# EAGLE design mm_robot_pcb_v2 (EAGLE 9.6.2)
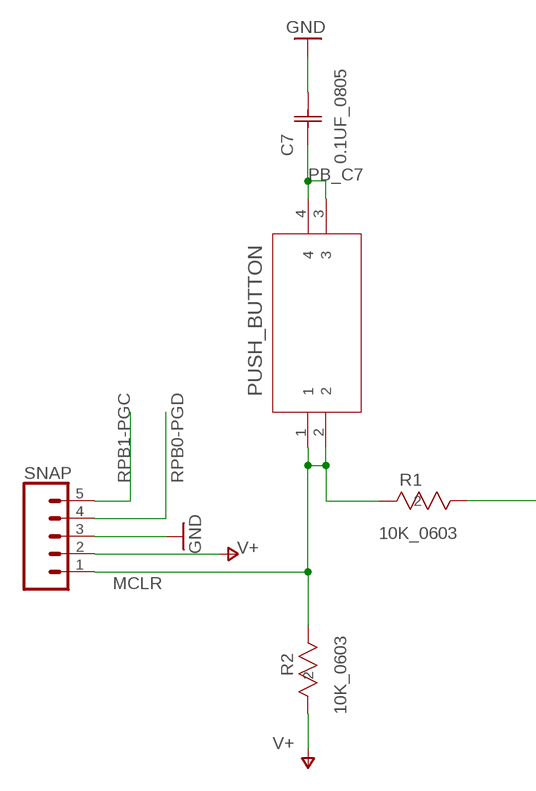
[diagram p0: schematic, sheet 1, part 1 of 2]
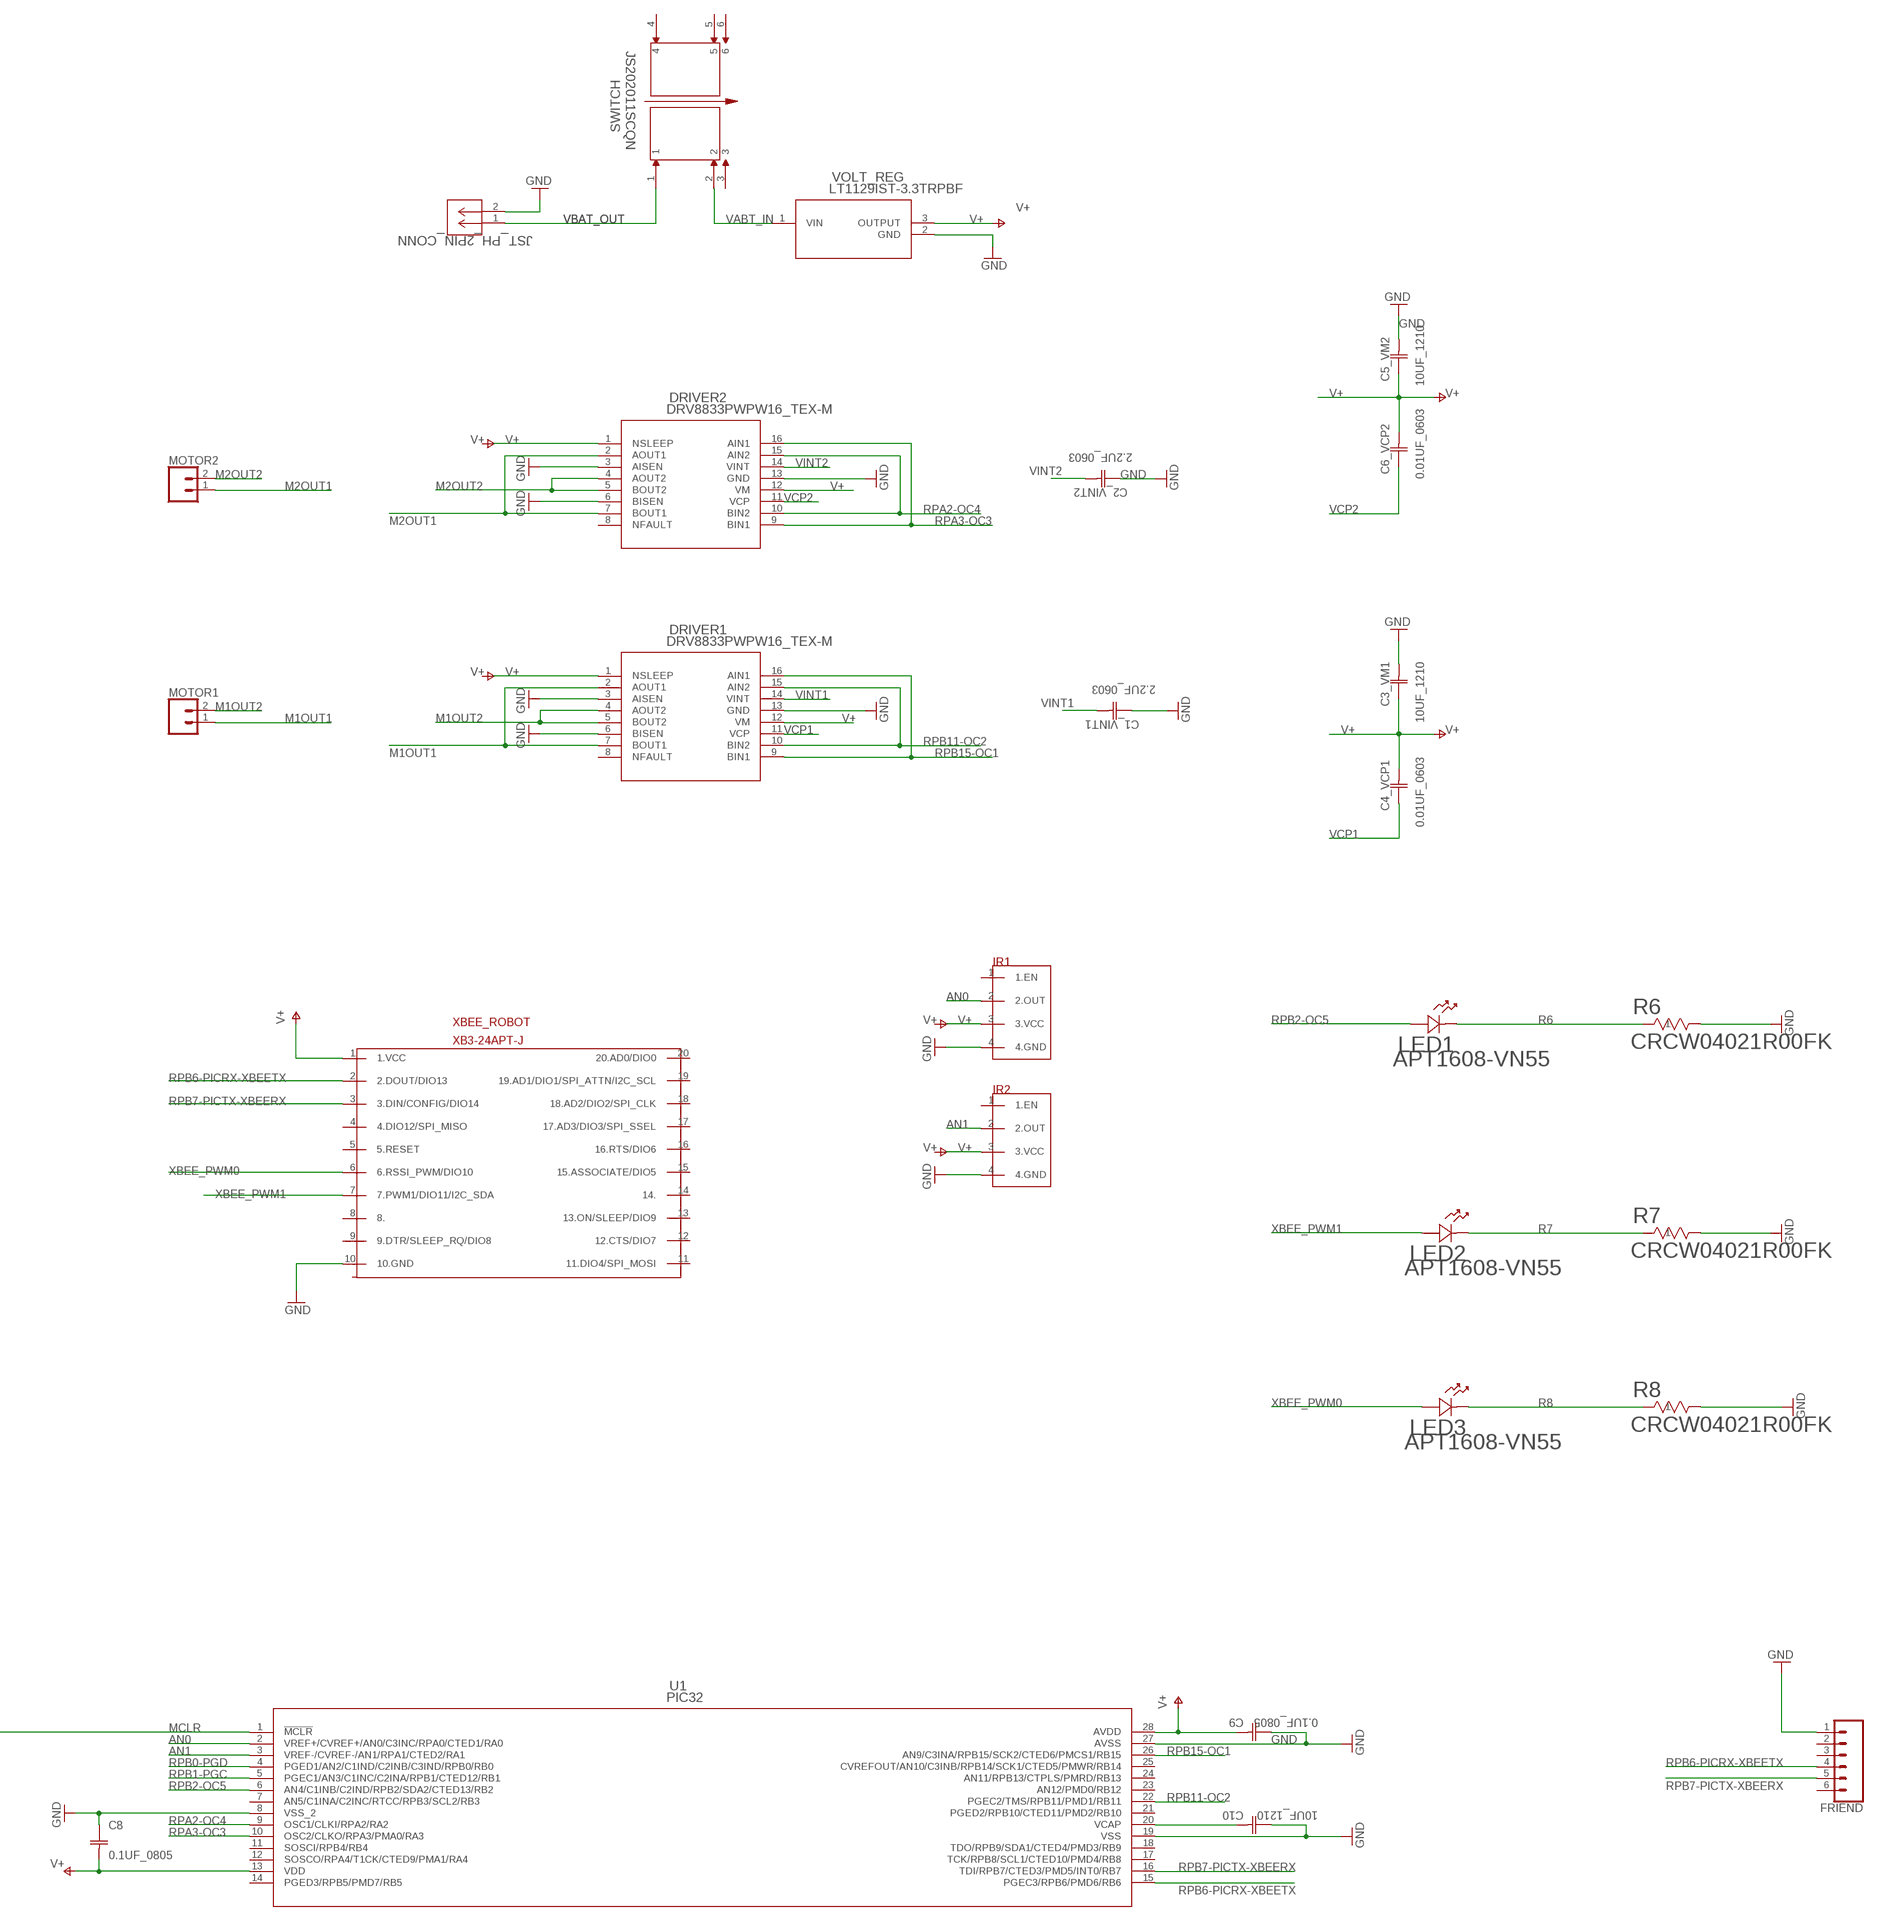
[diagram p1: schematic, sheet 1, part 2 of 2]

## Parts
C1_VINT1  2.2UF_0603  CL10A225KP8NNNC  [CAP_CL10_SAM]
C2_VINT2  2.2UF_0603  CL10A225KP8NNNC  [CAP_CL10_SAM]
C3_VM1  10UF_1210  TPSB106K016R0500  [CAP_TPS_B_AVX]
C4_VCP1  0.01UF_0603  01UF_CAP  [CAP_01UF_0603_X7R_G_AVX]
C5_VM2  10UF_1210  TPSB106K016R0500  [CAP_TPS_B_AVX]
C6_VCP2  0.01UF_0603  01UF_CAP  [CAP_01UF_0603_X7R_G_AVX]
C7  0.1UF_0805  C2012X7R2A104K125AA  [CAP_C2012X7R2A104K125AA_TDK]
C8  0.1UF_0805  C2012X7R2A104K125AA  [CAP_C2012X7R2A104K125AA_TDK]
C9  0.1UF_0805  C2012X7R2A104K125AA  [CAP_C2012X7R2A104K125AA_TDK]
C10  10UF_1210  TPSB106K016R0500  [CAP_TPS_B_AVX]
DRIVER1  DRV8833PWPW16_TEX-M  [PW16_TEX-M]
DRIVER2  DRV8833PWPW16_TEX-M  [PW16_TEX-M]
FRIEND  CONN_06LOCK  [1X06_LOCK]
IR1  GP2Y0A60SZLF  [1X04]
IR2  GP2Y0A60SZLF  [1X04]
JST_PH_2PIN_CONN  1769  [CONN_1769_ADA]
LED1  APT1608-VN55  [LED_APT1608_KNB]
LED2  APT1608-VN55  [LED_APT1608_KNB]
LED3  APT1608-VN55  [LED_APT1608_KNB]
MOTOR1  CONN_02  [1X02]
MOTOR2  CONN_02  [1X02]
R1  10K_0603  CRG0603F10K  [RES0603_CRG_TYCO_TYC]
R2  10K_0603  CRG0603F10K  [RES0603_CRG_TYCO_TYC]
R6  CRCW04021R00FK  [RES_CRCW0402_VIS]
R7  CRCW04021R00FK  [RES_CRCW0402_VIS]
R8  CRCW04021R00FK  [RES_CRCW0402_VIS]
SNAP  CONN_05  [1X05]
SWITCH  JS202011SCQN  [SW_JS202011SCQN]
U1  PIC32  PIC32MX170F256B-I/SS  [SSOP28_MC_MCH]
U2  PUSH_BUTTON  PTS526_SK15_SMTR2_LFS  [SMT_FS]
VOLT_REG  LT1129IST-3.3TRPBF  [SOT-223_ST_LIT]
XBEE_ROBOT  XB3-24APT-J  [XB3-24APT-J]

## Nets
AN0: IR1.2(2.OUT) U1.2(VREF+/CVREF+/AN0/C3INC/RPA0/CTED1/RA0)
AN1: IR2.2(2.OUT) U1.3(VREF-/CVREF-/AN1/RPA1/CTED2/RA1)
GND: C1_VINT1.1 C2_VINT2.1 C3_VM1.2 C5_VM2.2 C7.2 C8.1 C9.1 C10.1 DRIVER1.3(AISEN) DRIVER1.6(BISEN) DRIVER1.13(GND) DRIVER2.3(AISEN) DRIVER2.6(BISEN) DRIVER2.13(GND) FRIEND.1 IR1.4(4.GND) IR2.4(4.GND) JST_PH_2PIN_CONN.2 R6.2 R7.2 R8.2 SNAP.3 U1.8(VSS_2) U1.19(VSS) U1.27(AVSS) VOLT_REG.2(GND) XBEE_ROBOT.10(10.GND)
M1OUT1: DRIVER1.2(AOUT1) DRIVER1.7(BOUT1) MOTOR1.1
M1OUT2: DRIVER1.4(AOUT2) DRIVER1.5(BOUT2) MOTOR1.2
M2OUT1: DRIVER2.2(AOUT1) DRIVER2.7(BOUT1) MOTOR2.1
M2OUT2: DRIVER2.4(AOUT2) DRIVER2.5(BOUT2) MOTOR2.2
MCLR: R1.1 R1.2 R2.1 SNAP.1 U1.1(!MCLR) U2.1 U2.2
N$3: C10.2 U1.20(VCAP)
PB_C7: C7.1 U2.3 U2.4
R6: LED1.1 R6.1
R7: LED2.1 R7.1
R8: LED3.1 R8.1
RPA2-OC4: DRIVER2.10(BIN2) DRIVER2.15(AIN2) U1.9(OSC1/CLKI/RPA2/RA2)
RPA3-OC3: DRIVER2.9(BIN1) DRIVER2.16(AIN1) U1.10(OSC2/CLKO/RPA3/PMA0/RA3)
RPB0-PGD: SNAP.4 U1.4(PGED1/AN2/C1IND/C2INB/C3IND/RPB0/RB0)
RPB1-PGC: SNAP.5 U1.5(PGEC1/AN3/C1INC/C2INA/RPB1/CTED12/RB1)
RPB2-OC5: LED1.2 U1.6(AN4/C1INB/C2IND/RPB2/SDA2/CTED13/RB2)
RPB6-PICRX-XBEETX: FRIEND.4 U1.15(PGEC3/RPB6/PMD6/RB6) XBEE_ROBOT.2(2.DOUT/DIO13)
RPB7-PICTX-XBEERX: FRIEND.5 U1.16(TDI/RPB7/CTED3/PMD5/INT0/RB7) XBEE_ROBOT.3(3.DIN/CONFIG/DIO14)
RPB11-OC2: DRIVER1.10(BIN2) DRIVER1.15(AIN2) U1.22(PGEC2/TMS/RPB11/PMD1/RB11)
RPB15-OC1: DRIVER1.9(BIN1) DRIVER1.16(AIN1) U1.26(AN9/C3INA/RPB15/SCK2/CTED6/PMCS1/RB15)
V+: C3_VM1.1 C4_VCP1.2 C5_VM2.1 C6_VCP2.2 C8.2 C9.2 DRIVER1.1(NSLEEP) DRIVER1.12(VM) DRIVER2.1(NSLEEP) DRIVER2.12(VM) IR1.3(3.VCC) IR2.3(3.VCC) R2.2 SNAP.2 U1.13(VDD) U1.28(AVDD) VOLT_REG.3(OUTPUT) XBEE_ROBOT.1(1.VCC)
VABT_IN: SWITCH.2 VOLT_REG.1(VIN)
VBAT_OUT: JST_PH_2PIN_CONN.1 SWITCH.1
VCP1: C4_VCP1.1 DRIVER1.11(VCP)
VCP2: C6_VCP2.1 DRIVER2.11(VCP)
VINT1: C1_VINT1.2 DRIVER1.14(VINT)
VINT2: C2_VINT2.2 DRIVER2.14(VINT)
XBEE_PWM0: LED3.2 XBEE_ROBOT.6(6.RSSI_PWM/DIO10)
XBEE_PWM1: LED2.2 XBEE_ROBOT.7(7.PWM1/DIO11/I2C_SDA)
Unconnected: DRIVER1.8(NFAULT) DRIVER2.8(NFAULT) FRIEND.2 FRIEND.3 FRIEND.6 IR1.1(1.EN) IR2.1(1.EN) SWITCH.3 SWITCH.4 SWITCH.5 SWITCH.6 U1.7(AN5/C1INA/C2INC/RTCC/RPB3/SCL2/RB3) U1.11(SOSCI/RPB4/RB4) U1.12(SOSCO/RPA4/T1CK/CTED9/PMA1/RA4) U1.14(PGED3/RPB5/PMD7/RB5) U1.17(TCK/RPB8/SCL1/CTED10/PMD4/RB8) U1.18(TDO/RPB9/SDA1/CTED4/PMD3/RB9) U1.21(PGED2/RPB10/CTED11/PMD2/RB10) U1.23(AN12/PMD0/RB12) U1.24(AN11/RPB13/CTPLS/PMRD/RB13) U1.25(CVREFOUT/AN10/C3INB/RPB14/SCK1/CTED5/PMWR/RB14) XBEE_ROBOT.4(4.DIO12/SPI_MISO) XBEE_ROBOT.5(5.RESET) XBEE_ROBOT.8(8.) XBEE_ROBOT.9(9.DTR/SLEEP_RQ/DIO8) XBEE_ROBOT.11(11.DIO4/SPI_MOSI) XBEE_ROBOT.12(12.CTS/DIO7) XBEE_ROBOT.13(13.ON/SLEEP/DIO9) XBEE_ROBOT.14(14.) XBEE_ROBOT.15(15.ASSOCIATE/DIO5) XBEE_ROBOT.16(16.RTS/DIO6) XBEE_ROBOT.17(17.AD3/DIO3/SPI_SSEL) XBEE_ROBOT.18(18.AD2/DIO2/SPI_CLK) XBEE_ROBOT.19(19.AD1/DIO1/SPI_ATTN/I2C_SCL) XBEE_ROBOT.20(20.AD0/DIO0)

## Library data of the parts
C1_VINT1 C2_VINT2 = micromouse:CL10A225KP8NNNC; COPYRIGHT: Copyright (C) 2021 Ultra Librarian. All rights reserved.; MANUFACTURER_PART_NUMBER: CL10A225KP8NNNC; MFR_NAME: Samsung
C3_VM1 C5_VM2 C10 = micromouse:TPSB106K016R0500; COPYRIGHT: Copyright (C) 2021 Ultra Librarian. All rights reserved.; MANUFACTURER_PART_NUMBER: TPSB106K016R0500; MFR_NAME: AVX Corporation
C4_VCP1 C6_VCP2 = micromouse:01UF_CAP
C7-C9 = micromouse:C2012X7R2A104K125AA; COPYRIGHT: Copyright (C) 2021 Ultra Librarian. All rights reserved.; MANUFACTURER_PART_NUMBER: C2012X7R2A104K125AA; MFR_NAME: TDK
DRIVER1 DRIVER2 = DRV8833PW:DRV8833PW; COPYRIGHT: Copyright (C) 2021 Ultra Librarian. All rights reserved.; MANUFACTURER_PART_NUMBER: DRV8833PW; MFR_NAME: Texas Instruments
FRIEND = micromouse:CONN_06: Multi connection point. Often used as Generic Header-pin footprint for 0.1 inch spaced/style header connections On any of the 0.1 inch spaced packages, you can populate with these: Break Away Headers - Straight <https://www.sparkfun.com/products/116> (PRT-00116) Break Away Male Headers - Right Angle <https://www.sparkfun.com/products/553> (PRT-00553) Female Headers <https://www.sparkfun.com/products/115> (PRT-00115) Break Away Headers - Machine Pin <https://www.sparkfun.com/products/117> (PRT-00117) Break Away Female Headers - Swiss Machine Pin <https://www.sparkfun.com/products/743> (PRT-00743) Arduino Stackable Header - 6 Pin <https://www.sparkfun.com/products/9280> (PRT-09280) For SCREWTERMINALS and SPRING TERMINALS visit here: Screw Terimnals on SparkFun.com <https://www.sparkfun.com/search/results?term=Screw+Terminals> (5mm/3.5mm/2.54mm spacing) This device is also useful as a general connection point to wire up your design to another part of your project. Our various solder wires solder well into these plated through hole pads. Hook-Up Wire - Assortment (Stranded, 22 AWG) <https://www.sparkfun.com/products/11375> (PRT-11375) Hook-Up Wire - Assortment (Solid Core, 22 AWG) <https://www.sparkfun.com/products/11367> (PRT-11367) View the entire wire category on our website here <https://www.sparkfun.com/categories/141>
IR1 IR2 = micromouse:GP2Y0A60SZLF
JST_PH_2PIN_CONN = micromouse:1769; COPYRIGHT: Copyright (C) 2021 Ultra Librarian. All rights reserved.; MANUFACTURER_PART_NUMBER: 1769; MFR_NAME: Adafruit Industries
LED1-LED3 = micromouse:APT1608-VN55; COPYRIGHT: Copyright (C) 2021 Ultra Librarian. All rights reserved.; MANUFACTURER_PART_NUMBER: APT1608-VN55; MFR_NAME: Kingbright
MOTOR1 MOTOR2 = micromouse:CONN_02: Multi connection point. Often used as Generic Header-pin footprint for 0.1 inch spaced/style header connections On any of the 0.1 inch spaced packages, you can populate with these: Break Away Headers - Straight <https://www.sparkfun.com/products/116> (PRT-00116) Break Away Male Headers - Right Angle <https://www.sparkfun.com/products/553> (PRT-00553) Female Headers <https://www.sparkfun.com/products/115> (PRT-00115) Break Away Headers - Machine Pin <https://www.sparkfun.com/products/117> (PRT-00117) Break Away Female Headers - Swiss Machine Pin <https://www.sparkfun.com/products/743> (PRT-00743) For SCREWTERMINALS and SPRING TERMINALS visit here: Screw Terimnals on SparkFun.com <https://www.sparkfun.com/search/results?term=Screw+Terminals> (5mm/3.5mm/2.54mm spacing) This device is also useful as a general connection point to wire up your design to another part of your project. Our various solder wires solder well into these plated through hole pads. Hook-Up Wire - Assortment (Stranded, 22 AWG) <https://www.sparkfun.com/products/11375> (PRT-11375) Hook-Up Wire - Assortment (Solid Core, 22 AWG) <https://www.sparkfun.com/products/11367> (PRT-11367) View the entire wire category on our website here <https://www.sparkfun.com/categories/141> Special notes: Molex polarized connector foot print use with: PRT-08233 with associated crimp pins and housings. 2.54_SCREWTERM for use with PRT-10571. 3.5mm Screw Terminal footprints for PRT-08084 5mm Screw Terminal footprints for use with PRT-08432
R1 R2 = micromouse:CRG0603F10K; COPYRIGHT: Copyright (C) 2021 Ultra Librarian. All rights reserved.; MANUFACTURER_PART_NUMBER: CRG0603F10K; MFR_NAME: TE Connectivity
R6-R8 = micromouse:CRCW04021R00FK; COPYRIGHT: Copyright (C) 2021 Ultra Librarian. All rights reserved.; MANUFACTURER_PART_NUMBER: CRCW04021R00FK; MFR_NAME: Vishay
SNAP = micromouse:CONN_05: Multi connection point. Often used as Generic Header-pin footprint for 0.1 inch spaced/style header connections On any of the 0.1 inch spaced packages, you can populate with these: Break Away Headers - Straight <https://www.sparkfun.com/products/116> (PRT-00116) Break Away Male Headers - Right Angle <https://www.sparkfun.com/products/553> (PRT-00553) Female Headers <https://www.sparkfun.com/products/115> (PRT-00115) Break Away Headers - Machine Pin <https://www.sparkfun.com/products/117> (PRT-00117) Break Away Female Headers - Swiss Machine Pin <https://www.sparkfun.com/products/743> (PRT-00743) For SCREWTERMINALS and SPRING TERMINALS visit here: Screw Terimnals on SparkFun.com <https://www.sparkfun.com/search/results?term=Screw+Terminals> (5mm/3.5mm/2.54mm spacing) This device is also useful as a general connection point to wire up your design to another part of your project. Our various solder wires solder well into these plated through hole pads. Hook-Up Wire - Assortment (Stranded, 22 AWG) <https://www.sparkfun.com/products/11375> (PRT-11375) Hook-Up Wire - Assortment (Solid Core, 22 AWG) <https://www.sparkfun.com/products/11367> (PRT-11367) View the entire wire category on our website here <https://www.sparkfun.com/categories/141> Special notes: Molex polarized connector foot print use with SKU : PRT-08231 with associated crimp pins and housings. 1MM SMD Version SKU: PRT-10208
SWITCH = micromouse:JS202011SCQN; COPYRIGHT: Copyright (C) 2021 Ultra Librarian. All rights reserved.; MANUFACTURER_PART_NUMBER: JS202011SCQN; MFR_NAME: C&K
U1 = micromouse:PIC32MX170F256B-I/SS; COPYRIGHT: Copyright (C) 2021 Ultra Librarian. All rights reserved.; MANUFACTURER_PART_NUMBER: PIC32MX170F256B-I/SS; MFR_NAME: Microchip
U2 = micromouse:PTS526_SK15_SMTR2_LFS; COPYRIGHT: Copyright (C) 2021 Ultra Librarian. All rights reserved.; MANUFACTURER_PART_NUMBER: PTS526 SK15 SMTR2 LFS; MFR_NAME: C&K
VOLT_REG = LT1129IST-3.3#TRPBF:LT1129IST-3.3TRPBF; COPYRIGHT: Copyright (C) 2021 Ultra Librarian. All rights reserved.; MANUFACTURER_PART_NUMBER: LT1129IST-3.3#TRPBF; MFR_NAME: Analog Devices / Linear Technology
XBEE_ROBOT = micromouse:XB3-24APT-J

## Board
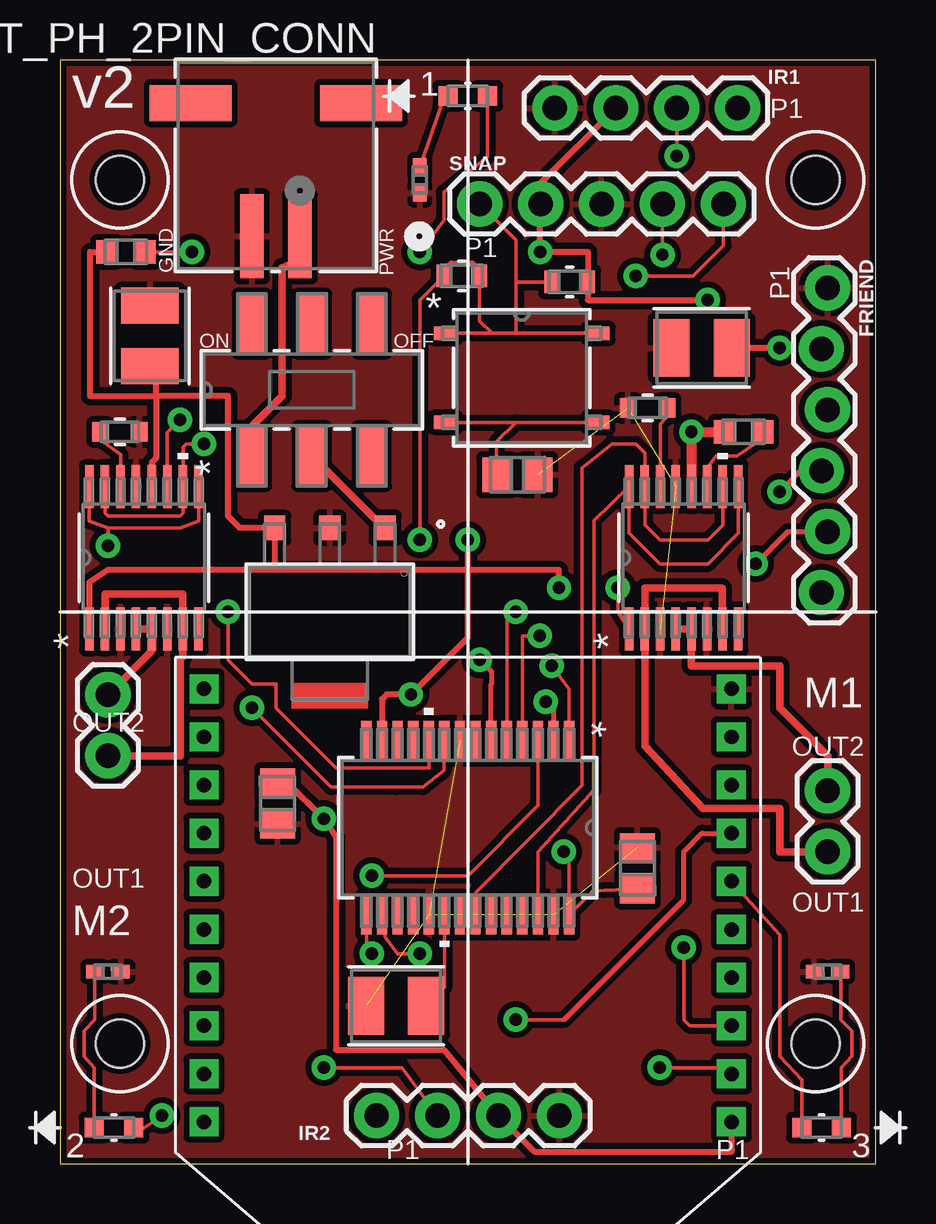
[diagram p2: board, top side]
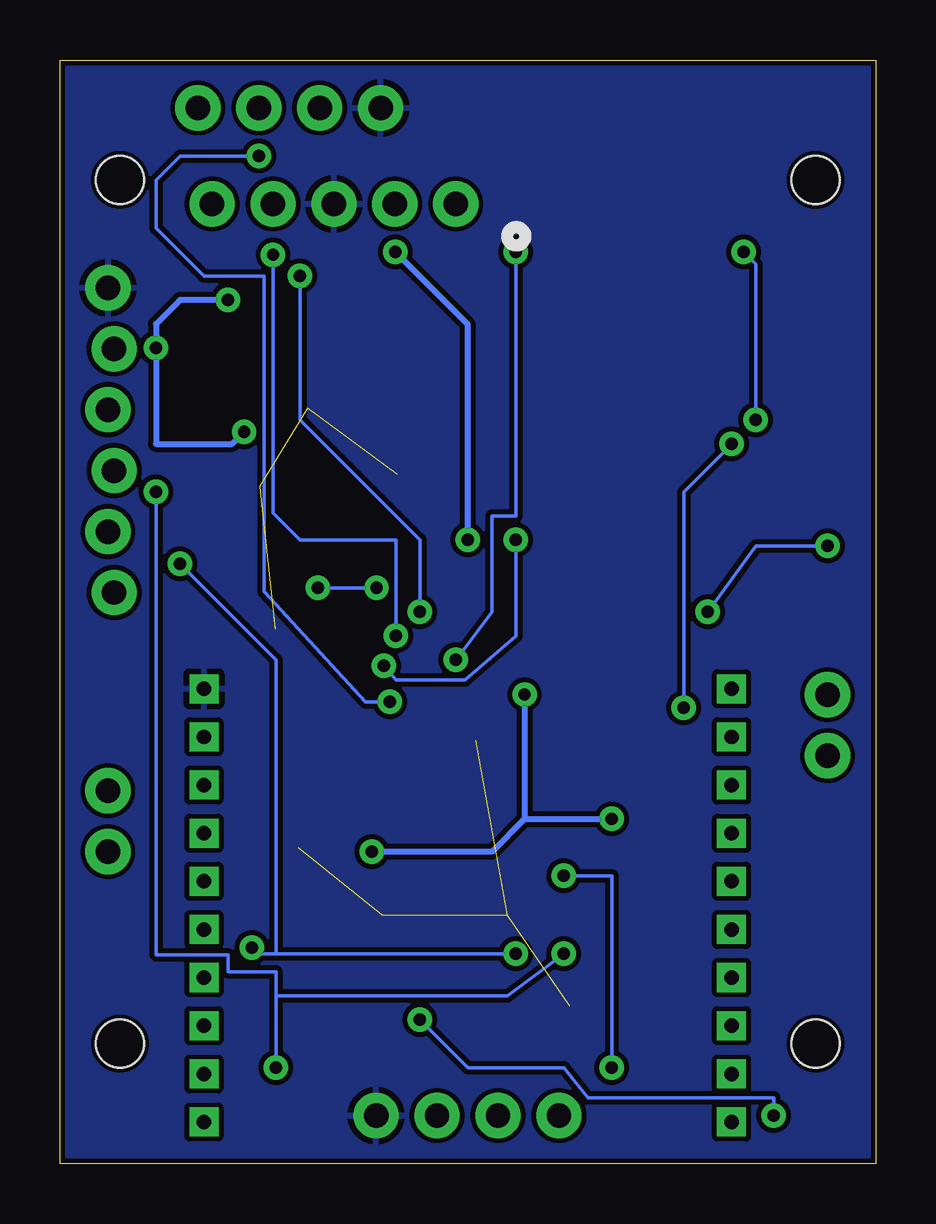
[diagram p3: board, bottom side, seen from below]

Size 34 x 46 mm. Coordinates in mm from the lower left corner, seen from the top.
Outline: 0,0 34,0 34,46 0,46 0,0
Copper layers (1*16): Top 0.035mm / dielectric 1.5mm / Bottom 0.035mm
Design rules "SparkFun": minimum track width 8mil, minimum drill 20mil, track to track 8mil, track to pad 8mil, pad to pad 8mil, via to via 8mil, smd to smd 8mil, copper to edge 8mil, drill to drill 8mil, minimum pad ring 12mil, minimum via ring 10mil, stop-mask expansion 4mil, vias tented up to drill 20mil, thermal gap 10mil
Holes 2 mm at 2.5,5 31.5,5 31.5,41 2.5,41

### Footprints (pad centres in the part's own frame; a part is rotated, then mirrored left to right if it is on the bottom)
CAP_CL10_SAM = smd 0.656 x 0.8: 1 -0.828,0; 2 0.828,0
CAP_TPS_B_AVX = smd 1.498 x 2.413: 1 -1.258,0; 2 1.258,0
CAP_01UF_0603_X7R_G_AVX = smd 0.864 x 0.965: 1 -0.8,0; 2 0.8,0
CAP_C2012X7R2A104K125AA_TDK = smd 1.194 x 1.448: 1 -0.864,0; 2 0.864,0
PW16_TEX-M = smd 1.778 x 0.356: 1 -2.972,2.275; 2 -2.972,1.625; 3 -2.972,0.975; 4 -2.972,0.325; 5 -2.972,-0.325; 6 -2.972,-0.975; 7 -2.972,-1.625; 8 -2.972,-2.275; 9 2.972,-2.275; 10 2.972,-1.625; 11 2.972,-0.975; 12 2.972,-0.325; 13 2.972,0.325; 14 2.972,0.975; 15 2.972,1.625; 16 2.972,2.275
1X06_LOCK = drill 1.016 pad 1.88: 1 0,0; 2 2.54,-0.254; 3 5.08,0; 4 7.62,-0.254; 5 10.16,0; 6 12.7,-0.254
1X04 = drill 1.016 pad 1.88: 1 0,0; 2 2.54,0; 3 5.08,0; 4 7.62,0
CONN_1769_ADA = smd 0.991 x 3.505: 1 0,0; 2 2,0 | smd 3.404 x 1.499: 3 -2.55,-5.55; 4 4.55,-5.55
LED_APT1608_KNB = smd 0.8 x 0.813: 1 -0.819,0; 2 0.819,0
1X02 = drill 1.016 pad 1.88: 1 0,0; 2 2.54,0
RES0603_CRG_TYCO_TYC = smd 0.61 x 0.94: 1 -0.749,0; 2 0.749,0
RES_CRCW0402_VIS = smd 0.711 x 0.559: 1 -0.546,0; 2 0.546,0
1X05 = drill 1.016 pad 1.88: 1 0,0; 2 2.54,0; 3 5.08,0; 4 7.62,0; 5 10.16,0
SW_JS202011SCQN = smd 2.489 x 1.194: 1 -2.756,2.5; 2 -2.756,0; 3 -2.756,-2.5; 4 2.756,-2.5; 5 2.756,0; 6 2.756,2.5
SSOP28_MC_MCH = smd 1.664 x 0.432: 1 -3.626,4.225; 2 -3.626,3.575; 3 -3.626,2.925; 4 -3.626,2.275; 5 -3.626,1.625; 6 -3.626,0.975; 7 -3.626,0.325; 8 -3.626,-0.325; 9 -3.626,-0.975; 10 -3.626,-1.625; 11 -3.626,-2.275; 12 -3.626,-2.925; 13 -3.626,-3.575; 14 -3.626,-4.225; 15 3.626,-4.225; 16 3.626,-3.575; 17 3.626,-2.925; 18 3.626,-2.275; 19 3.626,-1.625; 20 3.626,-0.975; 21 3.626,-0.325; 22 3.626,0.325; 23 3.626,0.975; 24 3.626,1.625; 25 3.626,2.275; 26 3.626,2.925; 27 3.626,3.575; 28 3.626,4.225
SMT_FS = smd 0.953 x 0.559: 1 -3.181,1.854; 2 3.181,1.854; 3 -3.181,-1.854; 4 3.181,-1.854
SOT-223_ST_LIT = smd 0.889 x 1.016: 1 -2.299,-3.493; 2 0,-3.493; 3 2.299,-3.493
XB3-24APT-J = drill 0.6 square: 1 -10.998,6.02; 2 -10.998,4.013; 3 -10.998,2.007; 4 -10.998,0; 5 -10.998,-2.007; 6 -10.998,-4.013; 7 -10.998,-6.02; 8 -10.998,-8.026; 9 -10.998,-10.033; 10 -10.998,-12.04; 11 10.998,-12.04; 12 10.998,-10.033; 13 10.998,-8.026; 14 10.998,-6.02; 15 10.998,-4.013; 16 10.998,-2.007; 17 10.998,0; 18 10.998,2.007; 19 10.998,4.013; 20 10.998,6.02

### Placement (x,y rotation side)
C1_VINT1  24.5,31.5 0 top
C2_VINT2  2.5,30.5 180 top
C3_VM1  26.75,34 180 top
C4_VCP1  28.5,30.5 180 top
C5_VM2  3.75,34.5 90 top
C6_VCP2  2.75,38 180 top
C7  19.07,28.71 0 top
C8  9.07,15.01 90 top
C9  24.07,12.31 270 top
C10  14.01,6.58 0 top
DRIVER1  26,25.25 90 top
DRIVER2  3.5,25.25 90 top
FRIEND  32,36.5 270 top
IR1  28.25,44 180 top
IR2  13.2,2 0 top
JST_PH_2PIN_CONN  10,38.65 180 top
LED1  17,44.5 0 top
LED2  2.25,1.5 0 top
LED3  31.75,1.5 180 top
MOTOR1  32,13 90 top
MOTOR2  2,17 90 top
R1  16.75,37 0 top
R2  21.25,36.75 0 top
R6  15,41 270 top
R7  2,8 0 top
R8  32,8 180 top
SNAP  17.5,40 0 top
SWITCH  10.5,32.25 90 top
U1  17,14 270 top
U2  19.25,32.75 0 top
VOLT_REG  11.25,23 180 top
XBEE_ROBOT  17,7.75 180 top

### Tracks (layer width: path | path; a pad name or v marks a point on that pad's centre or on a via)
AN0  (via drill 0.51)
  Top 0.152: IR1.2 v25.71,42
  Top 0.203: v20.25,19.25 20.57,18.93 U1.2
  Bottom 0.152: v20.25,19.25 21.25,19.25 25.5,23.84 25.5,37 28,37 30,39 30,41 29,42 v25.71,42
AN1  (via drill 0.51)
  Top 0.152: U1.3 19.93,14.93 17,12 v13,12 | v11,4 14.27,4 IR2.2
  Bottom 0.152: v13,12 11,12 v11,4
GND  (7 unrouted)
  pour Bottom (isolate 0.025): 0,0 34,0 34,46 0,46
  pour Top (isolate 0.254): 0,46 0,0 34,0 34,46
M1OUT1
  Top 0.152: 27.62,23.98 27.6,24 | 28.65,14.8
  Top 0.305: 27.6,24 24.38,24 DRIVER1.2 24.38,17.4 26.8,14.8 28.65,14.8 | DRIVER1.7 27.62,23.98 | 28.65,14.8 30,14.8 30,13 MOTOR1.1
M1OUT2
  Top 0.305: MOTOR1.2 32,17 30,19 30,20.75 26.32,20.75 DRIVER1.5 DRIVER1.4
M2OUT1
  Top 0.305: DRIVER2.2 1.88,23.75 5.12,23.75 DRIVER2.7 5.12,21.12 5,21 5,17 MOTOR2.1
M2OUT2
  Top 0.305: MOTOR2.2 3.83,21.36 DRIVER2.5 DRIVER2.4
MCLR  (via drill 0.51)
  Top 0.152: U2.1 18,34.6 | 18,34.6 19,34.6 | 19,34.6 U2.2 | SNAP.1 19,38.5 19,36.75 | 19,36.75 R2.1 | 19,36.75 19,34.6 | R1.2 17.5,35.1 18,34.6 | R1.1 15,36 v15,26 | v20.5,20.75 21.23,19.77 U1.1
  Top 0.203: R1.1 16.24,37.24 16.24,37.47 16.31,37.53 17.19,37.53 17.26,37.47 17.26,37.24 R1.2
  Bottom 0.152: v15,26 15,22 17.11,20.15 20,20.15 v20.5,20.75
N$3
  Top 0.152: U1.20 16.02,7.34 C10.2
PB_C7
  Top 0.152: U2.3 19,30.9 | 19,30.9 U2.4 | 19,30.9 18.21,30.1 C7.1
R6
  Top 0.152: LED1.1 16.03,44.5 R6.1
R7
  Top 0.152: R7.1 1.45,6 1,5.53 1,4.47 1.43,4 LED2.1
R8
  Top 0.152: R8.1 32.55,6 33,5.53 33,4.47 32.57,4 LED3.1
RPA2-OC4  (via drill 0.51)
  Top 0.152: DRIVER2.15 1.88,27.12 2,27 5,27 5.12,27.12 DRIVER2.10 5.12,29.88 5.25,30 v6,30 | U1.9 16,17.42 16,16.39 15.13,15.7 14,15.7 11.3,15.7 v8,19
  Bottom 0.152: v8,19 8,28 v6,30
RPA3-OC3  (via drill 0.51)
  Top 0.152: DRIVER2.16 1.23,26.77 2,26.5 | 2,26.5 5,26.5 5.78,26.77 DRIVER2.9 | U1.10 15.38,16.5 11.75,16.5 11.5,16.5 9,19 9,20 8,20 7,21 v7,23 | v2,25.75 2,26.5
  Bottom 0.152: v7,23 5,25.75 v2,25.75
RPB0-PGD  (via drill 0.51)
  Top 0.152: U1.4 19.27,22 v20,22 | v25.12,37.88 SNAP.4
  Bottom 0.152: v25.12,37.88 25.12,27.12 24,26 20,26 v20,22
RPB1-PGC  (via drill 0.51)
  Top 0.152: U1.5 18.62,22.62 v19,23 | v24,37 26.39,37 27.66,38.27 SNAP.5
  Bottom 0.152: v19,23 19,26 24,31 v24,37
RPB2-OC5  (via drill 0.51)
  Top 0.152: LED1.2 17.82,41.97 16,40.48 16,39.33 v15,38
  Top 0.203: U1.6 17.98,19.98 18,20 18,20.5 v17.5,21
  Bottom 0.152: v15,38 15,27 16,27 16,23 v17.5,21
RPB6-PICRX-XBEETX  (via drill 0.51)
  Top 0.152: U1.15 12.78,9.22 v13,8.75 | v25,4 27.73,4 XBEE_ROBOT.2
  Top 0.203: v30,28 30.88,28.88 FRIEND.4
  Bottom 0.152: v13,8.75 15.33,7 25,7 | 25,7 25,8 27,8 27,8.7 30,8.7 v30,28 | 25,7 v25,4
RPB7-PICTX-XBEERX  (via drill 0.51)
  Top 0.152: U1.16 13.55,10.17 13.55,9.45 14.08,8.75 v15,8.75 | v26,9 26,6 26.26,5.74 XBEE_ROBOT.3
  Top 0.203: v29,25 30.34,26.34 FRIEND.5
  Bottom 0.152: v15,8.75 25,8.75 | 25,8.75 25,21 v29,25 | v26,9 25.75,8.75 25,8.75
RPB11-OC2
  Top 0.152: U1.22 17.35,10.58 17.35,11.3 21.75,15.77 21.75,29 23,30 24,30 24.38,29.62 DRIVER1.15 24.38,26.62 25,26 27,26 27.62,26.62 DRIVER1.10
RPB15-OC1
  Top 0.152: U1.26 19.93,13 22.25,15.57 22.25,26.8 DRIVER1.16 23.73,26.27 25,25 27,25 28.27,26.27 DRIVER1.9
V+  (via drill 0.51)
  Top 0.152: v23.25,24 23.25,23 DRIVER1.1 | 20.02,39.98 SNAP.2 | 22,37 R2.2 22,37 | 9.5,15.87 C8.2 | v21,13 21.23,12.78 U1.28 22.22,11.37 C9.2
  Top 0.203: 22,38
  Top 0.254: 8.95,24.75 VOLT_REG.3 7.51,26.49 7,27 7,32 4,32 | v20.8,24 20.8,24.75 17,24.75 | 17,24.75 8.95,24.75 | 8.95,24.75 2,24.75 1.23,24.23 DRIVER2.1 | 17,24.75 v17,26 | 20.02,39.98 v20.02,38 22,38 | 22,38 22,37 | SNAP.2 20.04,40.87 IR1.3 | 17,24.75 17,21.92 v14.63,19.55 13.63,19.55 13.43,19.35 U1.13 | 9.5,15.87 v11,14.37 11.5,13.6 11.5,4.75 16,4.75 IR2.3 19.79,0.49 19.78,0.5 28,0.5 XBEE_ROBOT.1 | 22,37 22,36 v27,36 | v30,34 C3_VM1.1 | 4,32 1.25,32 1.25,38 C6_VCP2.2 | 4,32 4,29.4 3.83,29.22 DRIVER2.12 | 4,32 4,32.99 C5_VM2.1
  Top 0.406: C4_VCP1.2 v26.32,30.5 DRIVER1.12
  Bottom 0.152: v20.8,24 v23.25,24 | 20.02,37.98 v20.02,38
  Bottom 0.254: v17,26 17,34.96 20.02,37.98 | v14.63,19.55 14.63,14.37 | 14.63,14.37 v11,14.37 | 14.63,14.37 16,13 v21,13 | v27,36 29,36 30,35 v30,34 30,30 26.82,30 v26.32,30.5
VABT_IN
  Top 0.305: SWITCH.2 13.5,26.49 VOLT_REG.1
VBAT_OUT
  Top 0.305: JST_PH_2PIN_CONN.1 10,37.67 9.25,37.34 9.25,32 8,30.75 SWITCH.1
VCP1
  Top 0.152: DRIVER1.11 26.98,28.96 27.35,29.5 28.21,29.5 29,30.03 29,30.11 C4_VCP1.1
VCP2  (via drill 0.51)
  Top 0.152: DRIVER2.11 4.47,30.48 v5,31 | v5.5,38 C6_VCP2.1
  Bottom 0.152: v5.5,38 5,37.5 v5,31
VINT1
  Top 0.152: C1_VINT1.2 25.2,31.1 25.2,31 25.02,30.83 DRIVER1.14
VINT2
  Top 0.152: C2_VINT2.2 1.75,30.21 1.75,30.11 2.52,29.55 DRIVER2.14
XBEE_PWM0
  Top 0.152: LED3.2 30.93,3.5 30,4.47 30,9.53 XBEE_ROBOT.6
XBEE_PWM1  (via drill 0.51)
  Top 0.152: v19,6 21,6 | v4.25,2 3.5,1.5 LED2.2
  Top 0.203: 21,6 26,11 26,13 26.77,13.77 XBEE_ROBOT.7
  Bottom 0.152: v19,6 17,4 13,4 12,2.75 4.25,2.75 v4.25,2

### Text on the board
tPlace: IR1 | v2 | 1 | P1 | GND | PWR | P1 | P1 | ON | OFF | M1 | OUT2 | OUT2 | OUT1 | M2 | OUT1 | P1 | P1 | 2 | 3